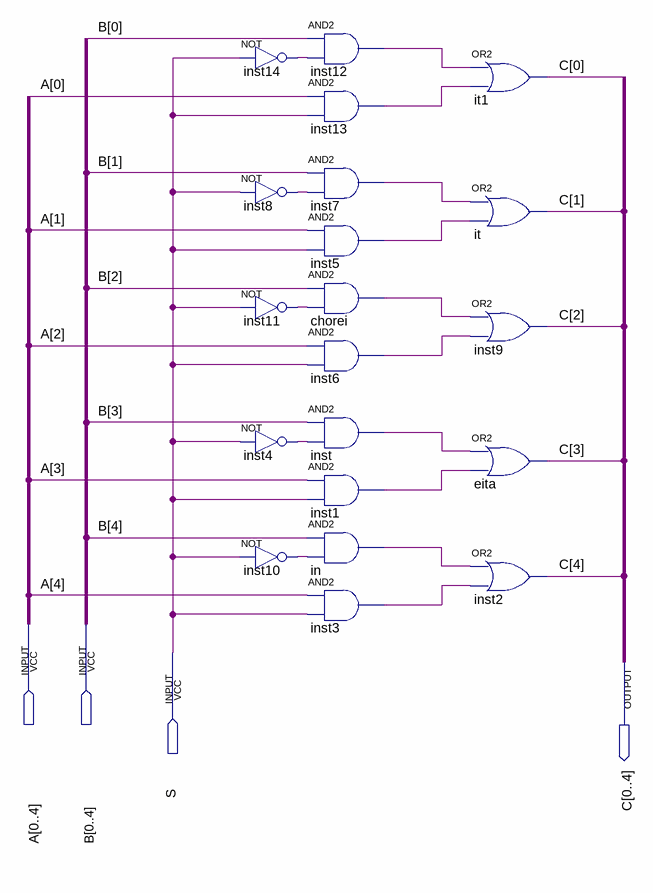
[diagram p0: schematic sheet]
// Quartus schematic muxSoma.bdf as structural Verilog: 20 symbols, 4 pins
module muxSoma (
  input  [0:4] A,
  input  [0:4] B,
  input  S,
  output [0:4] C
);

  wire chorei_out, in_out, inst1_out, inst3_out, inst4_out, inst5_out, inst6_out, inst7_out, inst8_out,
       inst10_out, inst11_out, inst12_out, inst13_out, inst14_out, inst_out;

  not inst14 (inst14_out, S);
  not inst8 (inst8_out, S);
  not inst11 (inst11_out, S);
  not inst4 (inst4_out, S);
  not inst10 (inst10_out, S);
  and inst12 (inst12_out, B[0], inst14_out);
  and inst13 (inst13_out, A[0], S);
  and inst7 (inst7_out, B[1], inst8_out);
  and inst5 (inst5_out, A[1], S);
  and chorei (chorei_out, B[2], inst11_out);
  and inst6 (inst6_out, A[2], S);
  and inst (inst_out, B[3], inst4_out);
  and inst1 (inst1_out, A[3], S);
  and in (in_out, B[4], inst10_out);
  and inst3 (inst3_out, A[4], S);
  or it1 (C[0], inst12_out, inst13_out);
  or it (C[1], inst7_out, inst5_out);
  or inst9 (C[2], chorei_out, inst6_out);
  or eita (C[3], inst_out, inst1_out);
  or inst2 (C[4], in_out, inst3_out);
endmodule
